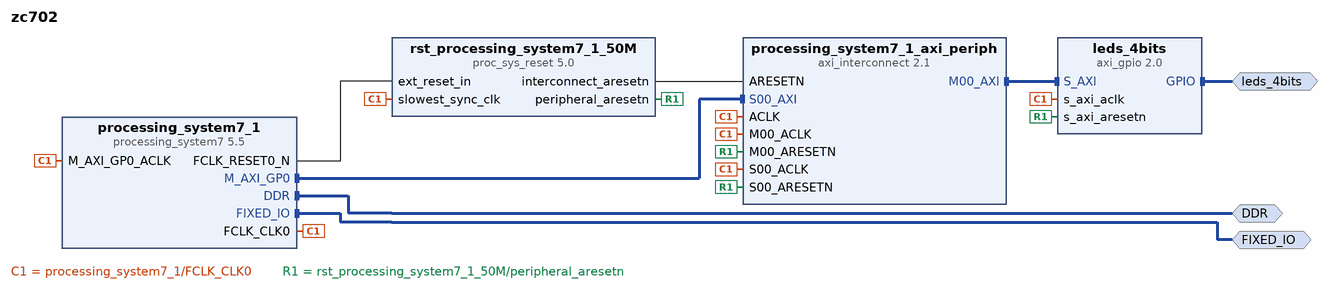
[diagram p0: block diagram of the top level]
# Vivado block design zc702, Vivado 2015.4
create_bd_design zc702

create_bd_intf_port -mode Master -vlnv xilinx.com:interface:ddrx_rtl:1.0 DDR
create_bd_intf_port -mode Master -vlnv xilinx.com:display_processing_system7:fixedio_rtl:1.0 FIXED_IO
create_bd_intf_port -mode Master -vlnv xilinx.com:interface:gpio_rtl:1.0 leds_4bits

create_bd_cell -type ip -vlnv xilinx.com:ip:processing_system7:5.5 processing_system7_1
set_property -dict {CONFIG.PCW_TTC0_PERIPHERAL_ENABLE 1 CONFIG.preset ZC702} [get_bd_cells processing_system7_1]
# 1 more settings of processing_system7_1 are not shown: defaults, MIO pin electricals, DDR timing, and values the tool derives
create_bd_cell -type ip -vlnv xilinx.com:ip:axi_gpio:2.0 leds_4bits
set_property -dict {CONFIG.USE_BOARD_FLOW true CONFIG.GPIO_BOARD_INTERFACE leds_4bits} [get_bd_cells leds_4bits]
create_bd_cell -type ip -vlnv xilinx.com:ip:axi_interconnect:2.1 processing_system7_1_axi_periph
set_property -dict {CONFIG.NUM_MI 1} [get_bd_cells processing_system7_1_axi_periph]
create_bd_cell -type ip -vlnv xilinx.com:ip:proc_sys_reset:5.0 rst_processing_system7_1_50M

# ---- connections ----

connect_bd_intf_net [get_bd_intf_pins processing_system7_1/M_AXI_GP0] [get_bd_intf_pins processing_system7_1_axi_periph/S00_AXI]
connect_bd_intf_net [get_bd_intf_pins processing_system7_1_axi_periph/M00_AXI] [get_bd_intf_pins leds_4bits/S_AXI]
connect_bd_intf_net [get_bd_intf_ports DDR] [get_bd_intf_pins processing_system7_1/DDR]
connect_bd_intf_net [get_bd_intf_ports FIXED_IO] [get_bd_intf_pins processing_system7_1/FIXED_IO]
connect_bd_intf_net [get_bd_intf_ports leds_4bits] [get_bd_intf_pins leds_4bits/GPIO]
connect_bd_net [get_bd_pins processing_system7_1/FCLK_CLK0] \
  [get_bd_pins processing_system7_1/M_AXI_GP0_ACLK] [get_bd_pins processing_system7_1_axi_periph/S00_ACLK] \
  [get_bd_pins rst_processing_system7_1_50M/slowest_sync_clk] [get_bd_pins processing_system7_1_axi_periph/ACLK] \
  [get_bd_pins leds_4bits/s_axi_aclk] [get_bd_pins processing_system7_1_axi_periph/M00_ACLK]
connect_bd_net [get_bd_pins processing_system7_1/FCLK_RESET0_N] [get_bd_pins rst_processing_system7_1_50M/ext_reset_in]
connect_bd_net [get_bd_pins rst_processing_system7_1_50M/peripheral_aresetn] \
  [get_bd_pins processing_system7_1_axi_periph/S00_ARESETN] [get_bd_pins leds_4bits/s_axi_aresetn] \
  [get_bd_pins processing_system7_1_axi_periph/M00_ARESETN]
connect_bd_net [get_bd_pins rst_processing_system7_1_50M/interconnect_aresetn] [get_bd_pins processing_system7_1_axi_periph/ARESETN]

# ---- address map ----
assign_bd_address -offset 0x41200000 -range 64K -target_address_space [get_bd_addr_spaces processing_system7_1/Data] [get_bd_addr_segs leds_4bits/S_AXI/Reg]

validate_bd_design
save_bd_design
